# EAGLE design ControlHVAC (EAGLE 7.2.0)
CNAME: Final Year Project; CREVISION: 1.0; DESIGNER: Adil Benabdallah
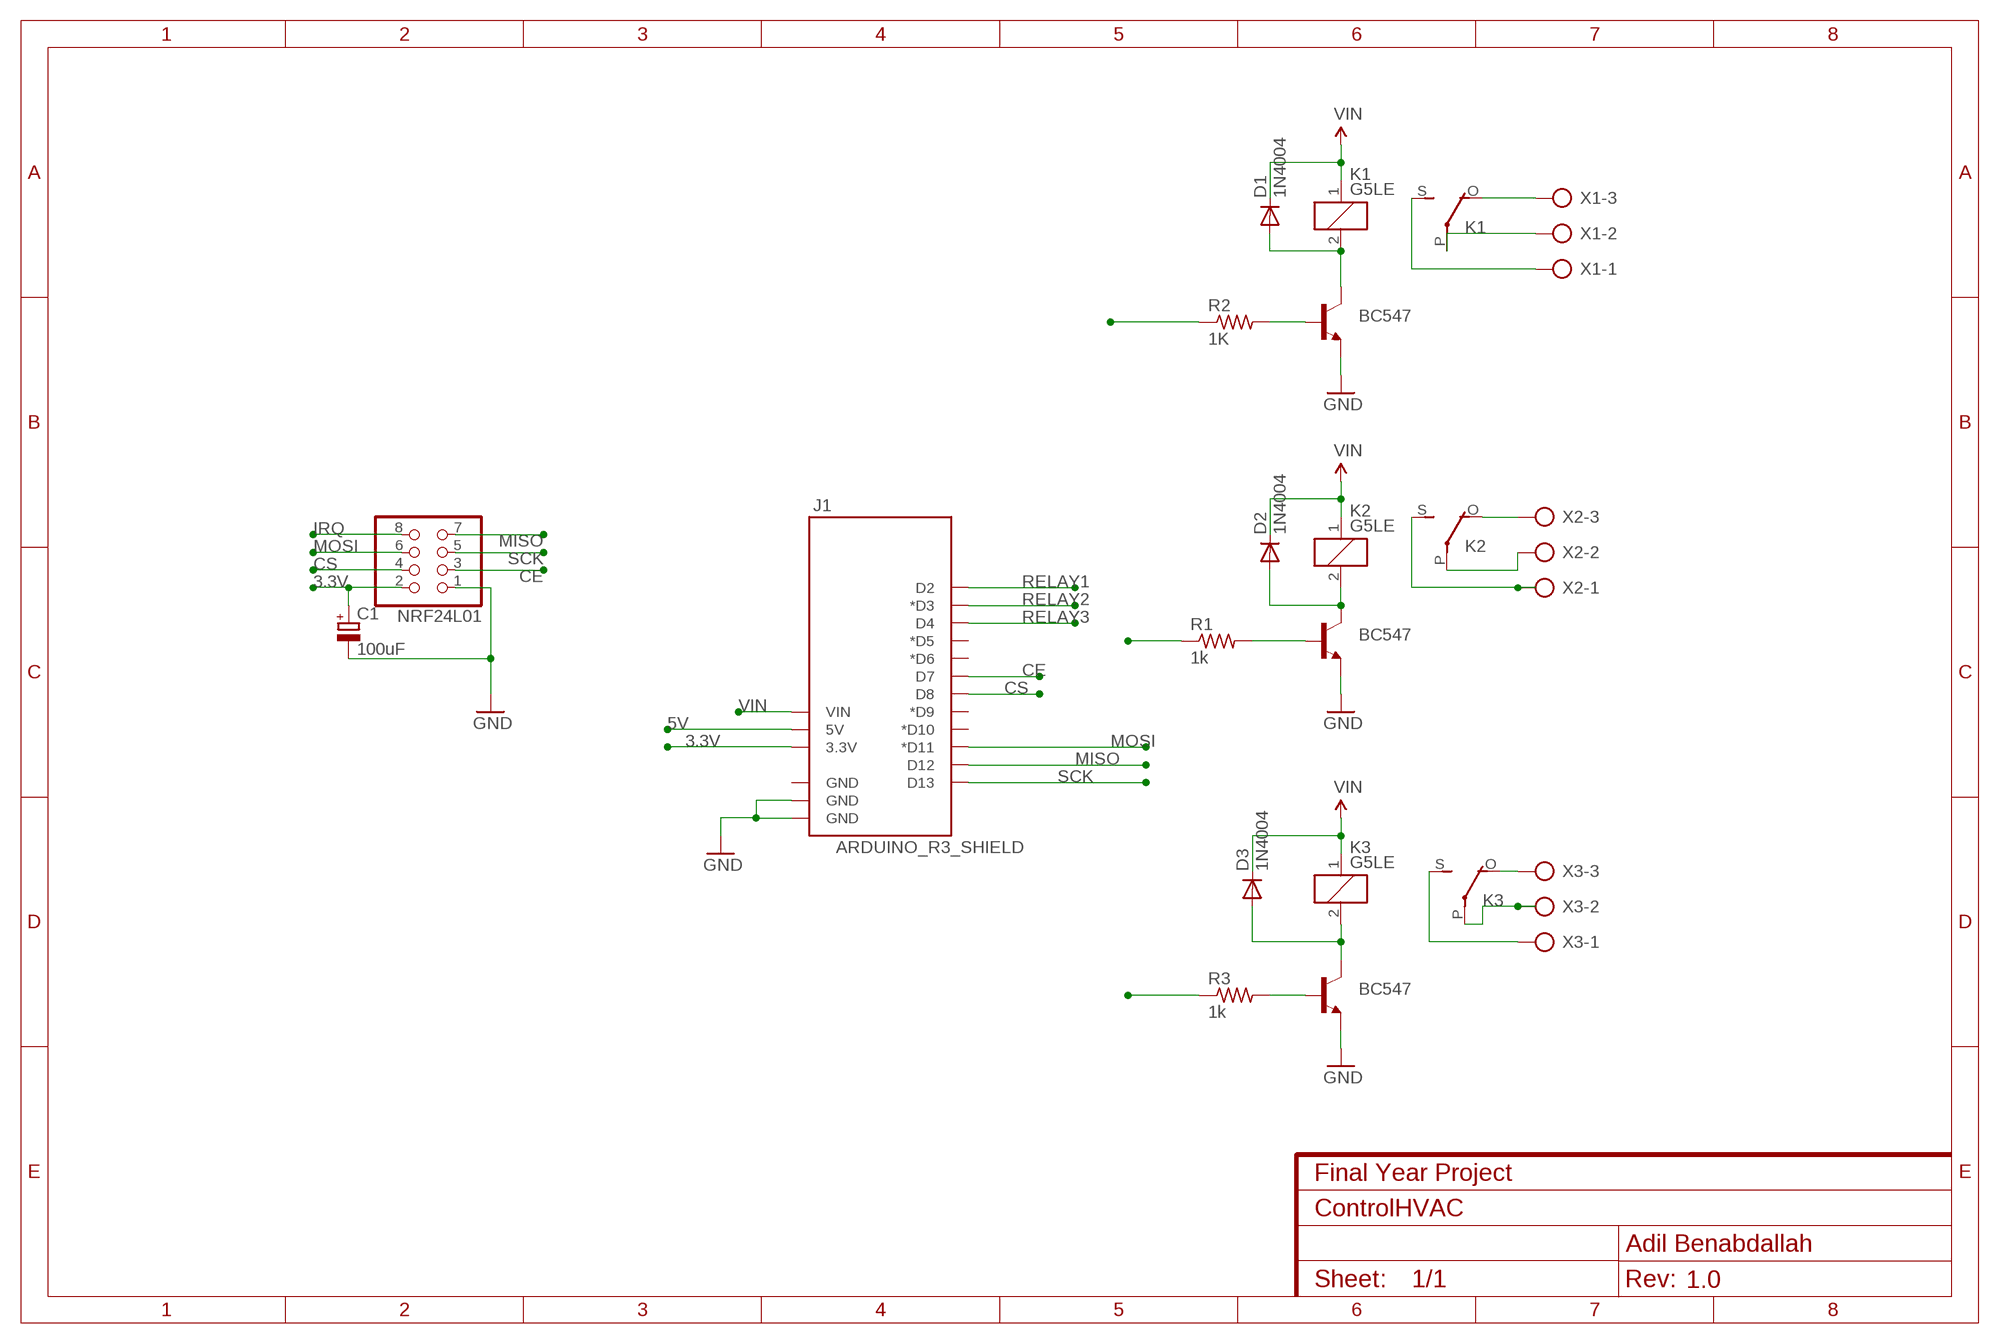
[diagram p0: schematic, sheet 1]

## Parts
C1  100uF  CPOL-EUE5-6  [E5-6]
D1  1N4004  [DO41-10]
D2  1N4004  [DO41-10]
D3  1N4004  [DO41-10]
J1  ARDUINO_R3_SHIELD  SINOVA_SHIELD  [UNO_R3_SHIELD]
K1  G5LE  [G5LE]
K2  G5LE  [G5LE]
K3  G5LE  [G5LE]
NRF24L01  PINHD-2X4  [2X04]
R1  1k  R-US_0204/7  [0204/7]
R2  1K  R-US_0204/7  [0204/7]
R3  1k  R-US_0204/7  [0204/7]
T1  BC547  [TO92]
T2  BC547  [TO92]
T3  BC547  [TO92]
X1  AK500/3-H  [AK500/3-H]
X2  AK500/3-H  [AK500/3-H]
X3  AK500/3-H  [AK500/3-H]

## Nets
3.3V: C1.+ J1.3.3V NRF24L01.2
5V: J1.5V
CE: J1.D7 NRF24L01.3
CS: J1.D8 NRF24L01.4
GND: C1.- J1.GND@0(GND) J1.GND@1(GND) NRF24L01.1 T1.1(E) T2.1(E) T3.1(E)
IRQ: NRF24L01.8
MISO: J1.D12 NRF24L01.7
MOSI: J1.D11(*D11) NRF24L01.6
N$1: D3.A K3.2 T3.3(C)
N$2: D2.A K2.2 T2.3(C)
N$3: D1.A K1.2 T1.3(C)
N$4: K2.O(2:O) X2.3
N$5: K2.P(2:P) X2.2
N$6: K2.S(2:S) X2.1
N$7: K3.O(2:O) X3.3
N$8: K3.P(2:P) X3.2
N$9: K3.S(2:S) X3.1
N$10: K1.S(2:S) X1.1
N$11: K1.P(2:P) X1.2
N$12: K1.O(2:O) X1.3
N$13: R2.2 T1.2(B)
N$14: R1.2 T2.2(B)
N$15: R3.2 T3.2(B)
RELAY1: J1.D2 R2.1
RELAY2: J1.D3(*D3) R1.1
RELAY3: J1.D4 R3.1
SCK: J1.D13 NRF24L01.5
VIN: D1.C D2.C D3.C J1.VIN K1.1 K2.1 K3.1
Unconnected: J1.D5(*D5) J1.D6(*D6) J1.D9(*D9) J1.D10(*D10) J1.GND@2(GND)

## Library data of the parts
C1 = rcl:CPOL-EU: POLARIZED CAPACITOR, European symbol
D1-D3 = diode:1N4004: DIODE general purpose rectifier, 1 A
J1 = Sinova:SINOVA_SHIELD: Shield form compatible with the Arduino Uno R3.
K1-K3 = relay:G5LE: RELAY 1 x switch, 10 A/120 V AC, 8 A/30 V DC, Omron; OC_FARNELL: unknown; OC_NEWARK: unknown
NRF24L01 = pinhead:PINHD-2X4: PIN HEADER
R1-R3 = rcl:R-US_: RESISTOR, American symbol
T1-T3 = transistor:BC547: NPN TRANSISTOR
X1-X3 = con-ptr500:AK500/3-H: CONNECTOR Aug. 2004 / PTR Meßtechnik: Die Bezeichnung der Serie AK505 wurde geändert. Es handelt sich hierbei um AK500 in horizontaler Ausführung.; OC_FARNELL: unknown; OC_NEWARK: unknown

## Board
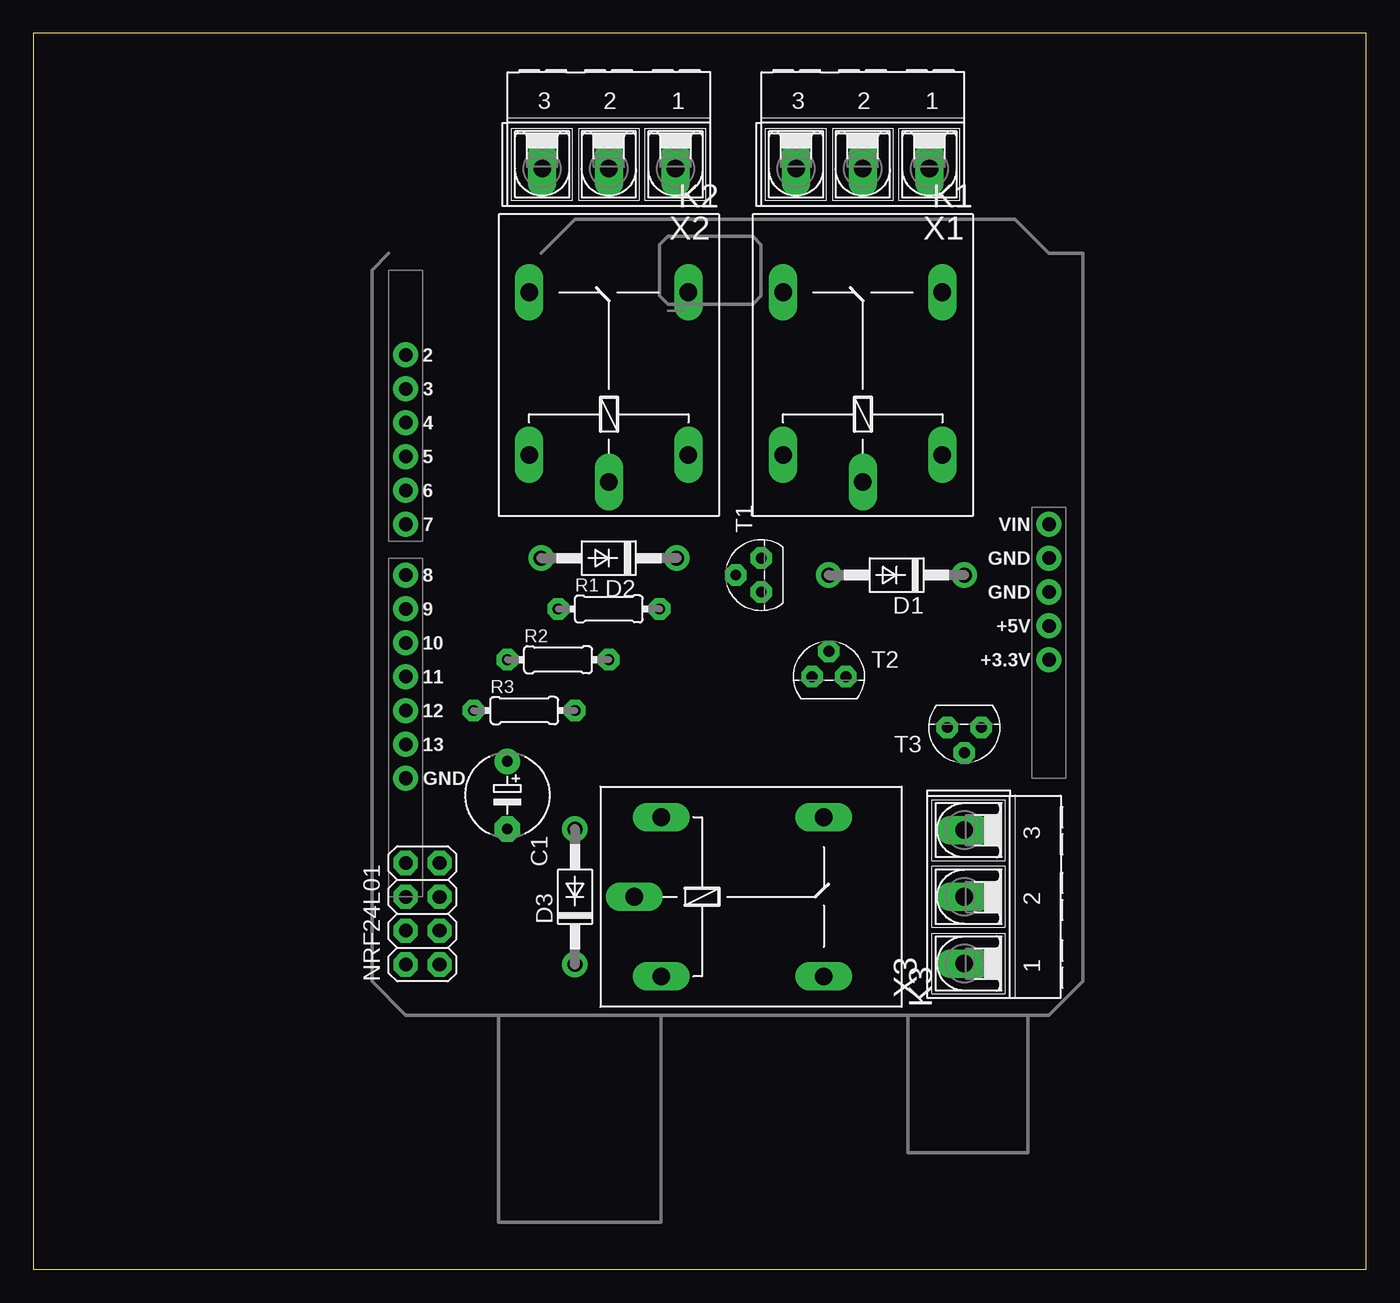
[diagram p1: board, top side]
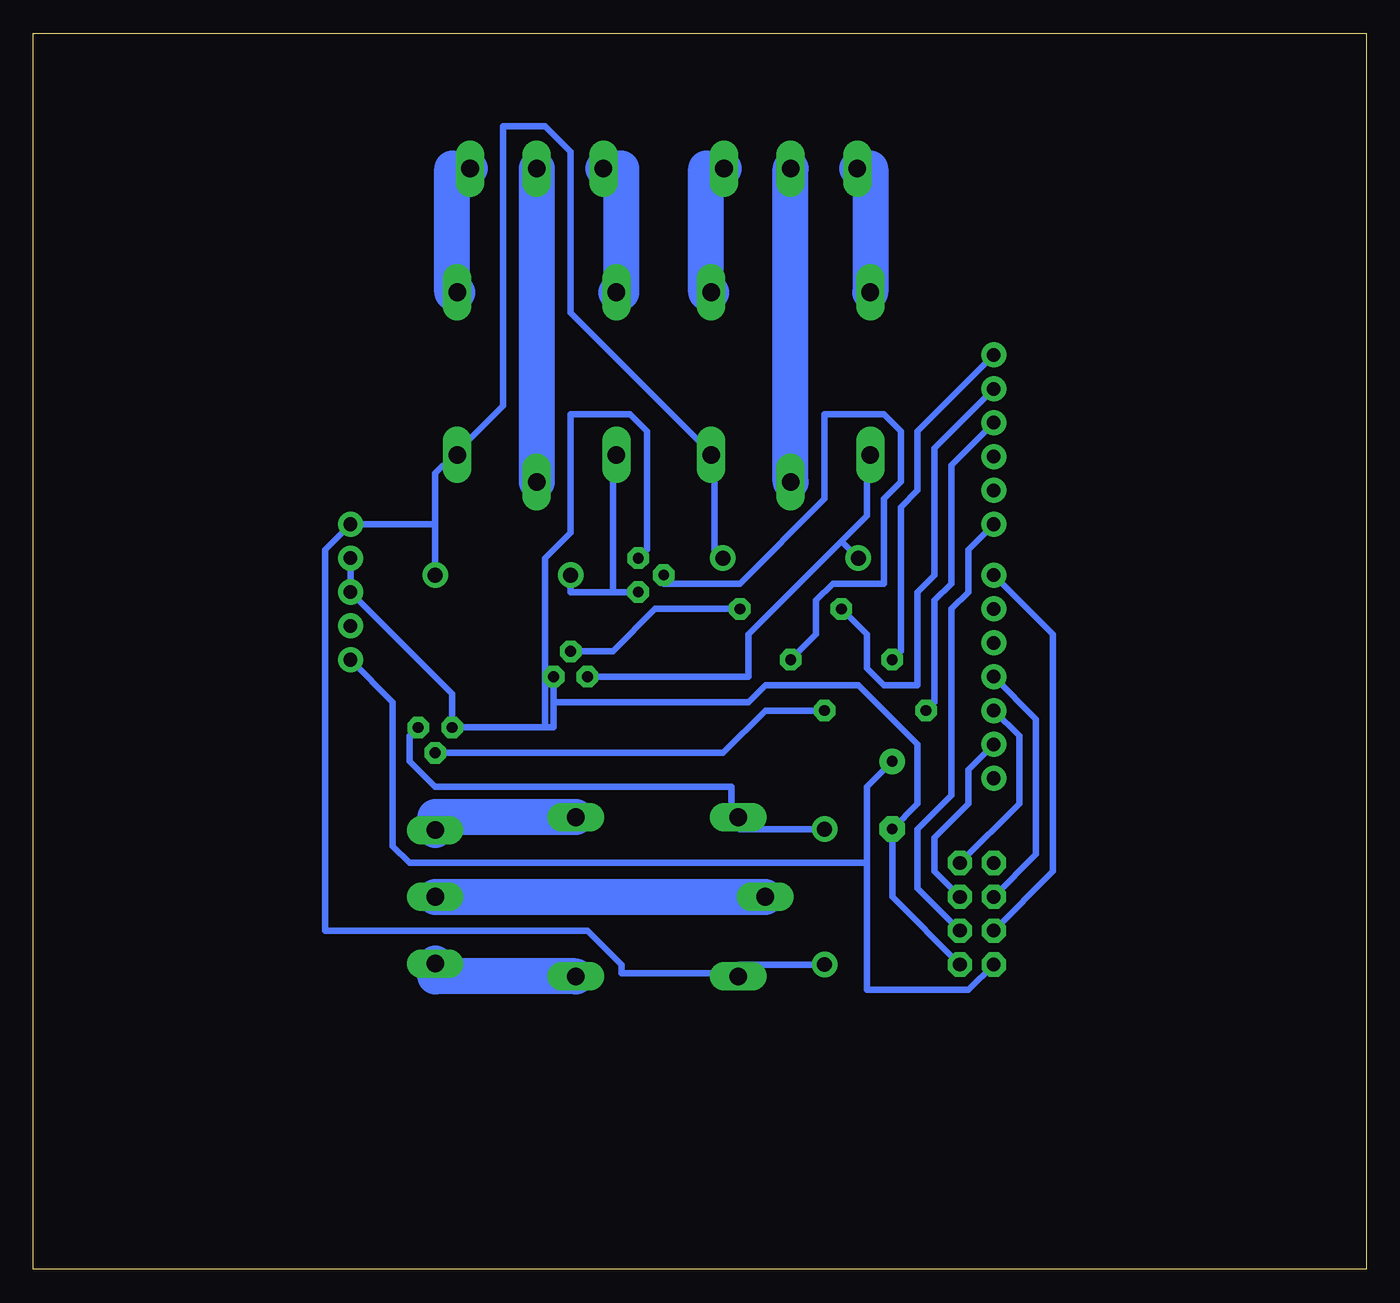
[diagram p2: board, bottom side, seen from below]

Size 100 x 92.7 mm. Coordinates in mm from the lower left corner, seen from the top.
Outline: 0,0 100,0 100,92.7 0,92.7 0,0
Copper layers (1*16): Top 0.035mm / dielectric 1.5mm / Bottom 0.035mm
Design rules "default *": minimum track width 0.5mm, minimum drill 24mil, track to track 0.6mm, track to pad 0.6mm, pad to pad 0.45mm, via to via 0.8mm, smd to smd 8mil, copper to edge 40mil, drill to drill 8mil, minimum pad ring 0.4mm, minimum via ring 0.4mm, stop-mask expansion 4mil, vias tented up to drill 0mil, thermal gap 10mil

### Footprints (pad centres in the part's own frame; a part is rotated, then mirrored left to right if it is on the bottom)
E5-6 = drill 0.813 pad 1.905: + -2.54,0 | drill 0.813 pad 1.905 octagon: - 2.54,0
DO41-10 = drill 1.118: A 5.08,0; C -5.08,0
UNO_R3_SHIELD = drill 1.016 pad 1.88: 3.3V 50.8,26.67; 5V 50.8,29.21; D2 2.54,49.53; D3 2.54,46.99; D4 2.54,44.45; D5 2.54,41.91; D6 2.54,39.37; D7 2.54,36.83; D8 2.54,33.02; D9 2.54,30.48; D10 2.54,27.94; D11 2.54,25.4; D12 2.54,22.86; D13 2.54,20.32; GND@0 50.8,31.75; GND@1 50.8,34.29; GND@2 2.54,17.78; VIN 50.8,36.83
G5LE = drill 1.321 long: 1 -7.493,-5.969; 2 -7.493,5.969; O 4.699,5.969; P -9.525,0; S 4.699,-5.969
2X04 = drill 1.016 octagon: 1 -3.81,-1.27; 2 -3.81,1.27; 3 -1.27,-1.27; 4 -1.27,1.27; 5 1.27,-1.27; 6 1.27,1.27; 7 3.81,-1.27; 8 3.81,1.27
0204/7 = drill 0.813 octagon: 1 -3.81,0; 2 3.81,0
TO92 = drill 0.813 octagon: 1 1.27,0; 2 0,1.905; 3 -1.27,0
AK500/3-H = drill 1.321 long: 1 -5.004,0; 2 0,0; 3 5.004,0

### Placement (x,y rotation side)
C1  35.56,35.56 270 top
D1  64.77,52.07 180 top
D2  43.18,53.34 180 top
D3  40.64,27.94 90 top
J1  25.4,19.05 0 top
K1  62.23,68.58 90 top
K2  43.18,68.58 90 top
K3  54.61,27.94 0 top
NRF24L01  29.21,26.67 90 top
R1  43.18,49.53 0 top
R2  39.37,45.72 0 top
R3  36.83,41.91 0 top
T1  54.61,52.07 90 top
T2  59.69,44.45 0 top
T3  69.85,40.64 180 top
X1  62.23,82.55 180 top
X2  43.18,82.55 180 top
X3  69.85,27.94 90 top

### Tracks (layer width: path | path; a pad name or v marks a point on that pad's centre or on a via)
3.3V
  Bottom 0.5: NRF24L01.2 29.84,20.95 37.47,20.95 37.47,30.48 | 37.47,30.48 37.47,36.2 C1.+ | J1.3.3V 73.03,42.55 73.03,31.75 71.75,30.48 37.47,30.48
CE
  Bottom 0.5: NRF24L01.3 33.66,28.57 33.66,33.02 31.11,35.56 31.11,49.53 29.84,50.8 29.84,53.97 J1.D7
CS
  Bottom 0.5: NRF24L01.4 23.5,29.84 23.5,47.62 J1.D8
GND
  Bottom 0.5: NRF24L01.1 35.56,27.94 C1.- 33.66,34.92 33.66,39.37 38.1,43.81 45.09,43.81 46.35,42.55 60.96,42.55 | J1.GND@1 J1.GND@0 68.58,43.18 T3.1 61.59,40.64 | 61.59,40.64 60.96,40.64 60.96,42.55 | T2.1 60.96,42.55 | T1.1 53.98,53.97 53.98,62.86 55.24,64.14 59.69,64.14 59.69,55.25 61.59,53.34 61.59,40.64
MISO
  Bottom 0.5: NRF24L01.7 26.04,34.92 26.04,40 J1.D12
MOSI
  Bottom 0.5: NRF24L01.6 24.77,31.11 24.77,41.27 J1.D11
N$1
  Bottom 0.5: T3.3 71.75,40 71.75,38.1 69.85,36.2 47.62,36.2 47.62,34.29 K3.2 46.99,33.66 46.99,33.02 D3.A
N$2
  Bottom 0.5: T2.3 46.35,44.45 46.35,47.62 39.37,54.61 | 39.37,54.61 37.47,56.52 37.47,60.96 K2.2 | 39.37,54.61 D2.A
N$3
  Bottom 0.5: 56.52,50.8 59.69,50.8 D1.A | 56.52,50.8 T1.3 | 56.52,50.8 56.52,60.96 K1.2
N$4
  Bottom 2.7: X2.3 37.21,82.55 K2.O
N$5
  Bottom 2.7: K2.P X2.2
N$6
  Bottom 2.7: K2.S 49.53,73.28 49.53,82.55 X2.1
N$7
  Bottom 2.7: X3.3 69.85,33.91 K3.O
N$8
  Bottom 2.7: X3.2 K3.P
N$9
  Bottom 2.7: X3.1 69.85,21.97 K3.S
N$10
  Bottom 2.7: K1.S 68.58,73.28 68.58,82.55 X1.1
N$11
  Bottom 2.7: X1.2 K1.P
N$12
  Bottom 2.7: K1.O 55.88,73.28 55.88,82.55 X1.3
N$13
  Bottom 0.5: R2.2 41.27,47.62 41.27,50.17 40.01,51.44 36.2,51.44 36.2,57.78 34.92,59.05 34.92,62.86 36.2,64.14 40.64,64.14 40.64,57.78 46.99,51.44 52.7,51.44 T1.2
N$14
  Bottom 0.5: R1.2 53.34,49.53 56.52,46.36 T2.2
N$15
  Bottom 0.5: R3.2 45.09,41.91 48.26,38.73 T3.2
RELAY1
  Bottom 0.5: R2.1 34.92,46.36 34.92,57.15 33.66,58.42 33.66,62.86 J1.D2
RELAY2
  Bottom 0.5: R1.1 37.47,47.62 37.47,45.08 36.2,43.81 33.66,43.81 33.66,50.8 32.38,52.07 32.38,61.59 J1.D3
RELAY3
  Bottom 0.5: R3.1 32.38,42.55 32.38,50.17 31.11,51.44 31.11,60.33 J1.D4
SCK
  Bottom 0.5: NRF24L01.5 32.38,29.84 32.38,32.38 29.84,34.92 29.84,37.47 J1.D13
VIN
  Bottom 0.5: D2.C 48.9,53.97 48.9,60.96 K2.1 49.53,61.59 59.69,71.75 59.69,83.82 61.59,85.73 64.77,85.73 64.77,64.77 67.94,61.59 K1.1 68.58,60.96 69.85,59.69 69.85,55.88 | D3.C 46.99,22.86 46.99,22.23 K3.1 47.62,22.23 55.88,22.23 55.88,22.86 58.42,25.4 78.11,25.4 78.11,53.97 J1.VIN 69.85,55.88 | D1.C 69.85,55.88